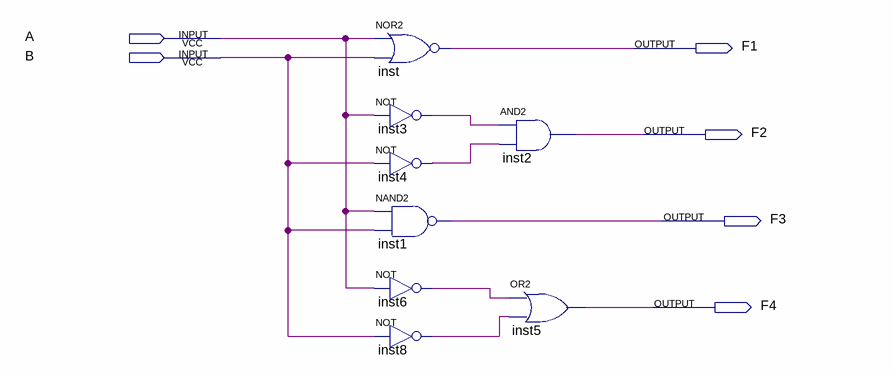
[diagram p0: schematic sheet]
// Quartus schematic Demorgan26.bdf as structural Verilog: 8 symbols, 6 pins
module Demorgan26 (
  input  A,
  input  B,
  output F1,
  output F2,
  output F3,
  output F4
);

  wire inst3_out, inst4_out, inst6_out, inst8_out;

  nor inst (F1, A, B);
  not inst3 (inst3_out, A);
  not inst4 (inst4_out, B);
  nand inst1 (F3, A, B);
  not inst6 (inst6_out, A);
  not inst8 (inst8_out, B);
  and inst2 (F2, inst3_out, inst4_out);
  or inst5 (F4, inst6_out, inst8_out);
endmodule
